# Altium project fitkit4.PrjPcb (part 1 of 2)
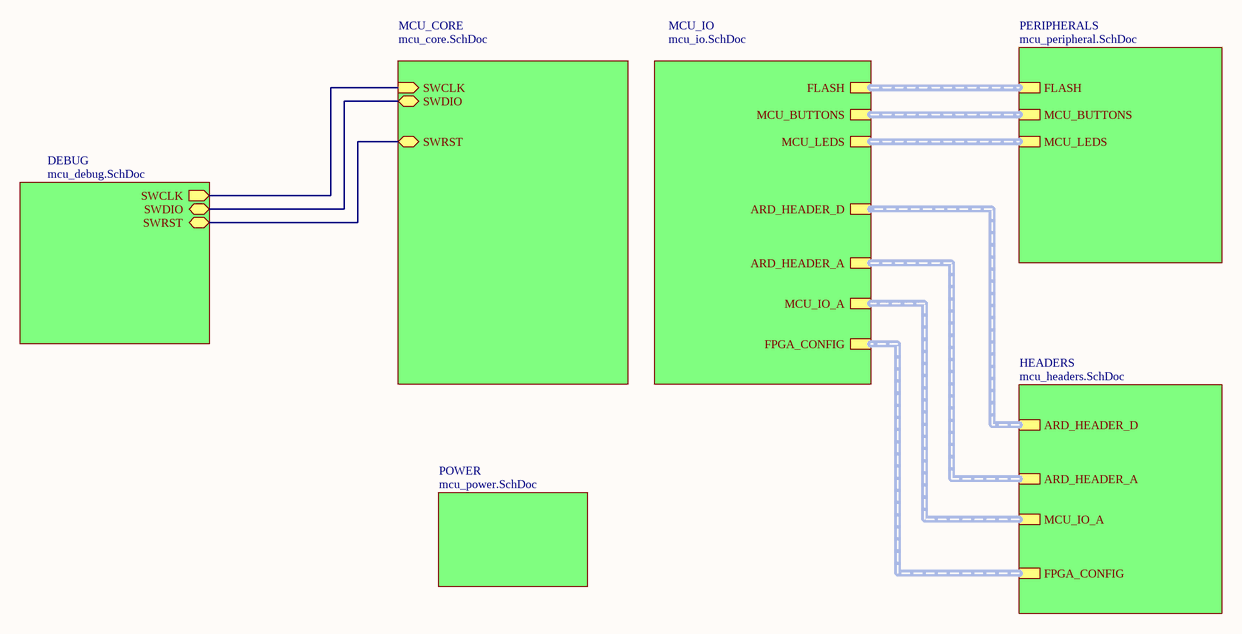
[diagram p0: arm_board.SchDoc]
7 sheets, 88 parts. Net scope: hierarchical (ports join the sheet entries above them; power ports are global).
Board file: arm_board_n.PcbDoc
Sheets:
  arm_board.SchDoc
    MCU_CORE = mcu_core.SchDoc
    DEBUG = mcu_debug.SchDoc
    PERIPHERALS = mcu_peripheral.SchDoc
    POWER = mcu_power.SchDoc
    HEADERS = mcu_headers.SchDoc
    MCU_IO = mcu_io.SchDoc

## Sheet arm_board.SchDoc
size A4

### Sub-sheets
DEBUG = mcu_debug.SchDoc: SWCLK (out), SWDIO (bidir), SWRST (bidir)
HEADERS = mcu_headers.SchDoc: ARD_HEADER_D (harness ARD_HEADER_D), ARD_HEADER_A (harness ARD_HEADER_A), MCU_IO_A (harness MCU_IO_A), FPGA_CONFIG (harness FPGA_CONFIG)
MCU_CORE = mcu_core.SchDoc: SWDIO (bidir), SWCLK (in), SWRST (bidir)
MCU_IO = mcu_io.SchDoc: FLASH (harness FLASH), MCU_BUTTONS (harness MCU_BUTTONS), MCU_LEDS (harness MCU_LEDS), ARD_HEADER_D (harness ARD_HEADER_D), ARD_HEADER_A (harness ARD_HEADER_A), MCU_IO_A (harness MCU_IO_A), FPGA_CONFIG (harness FPGA_CONFIG)
PERIPHERALS = mcu_peripheral.SchDoc: FLASH (harness FLASH), MCU_BUTTONS (harness MCU_BUTTONS), MCU_LEDS (harness MCU_LEDS)
POWER = mcu_power.SchDoc: no entries

### Nets
NetC11_1: sheet MCU_CORE/SWRST, sheet DEBUG/SWRST
NetIC1_P27: sheet MCU_CORE/SWCLK, sheet DEBUG/SWCLK
NetIC1_P30: sheet MCU_CORE/SWDIO, sheet DEBUG/SWDIO

### Buses and harness runs
harness sheet HEADERS/ARD_HEADER_A = sheet MCU_IO/ARD_HEADER_A
harness sheet HEADERS/ARD_HEADER_D = sheet MCU_IO/ARD_HEADER_D
harness sheet HEADERS/FPGA_CONFIG = sheet MCU_IO/FPGA_CONFIG
harness sheet HEADERS/MCU_IO_A = sheet MCU_IO/MCU_IO_A
harness sheet MCU_IO/FLASH = sheet PERIPHERALS/FLASH
harness sheet MCU_IO/MCU_BUTTONS = sheet PERIPHERALS/MCU_BUTTONS
harness sheet MCU_IO/MCU_LEDS = sheet PERIPHERALS/MCU_LEDS

## Sheet mcu_core.SchDoc
size A4
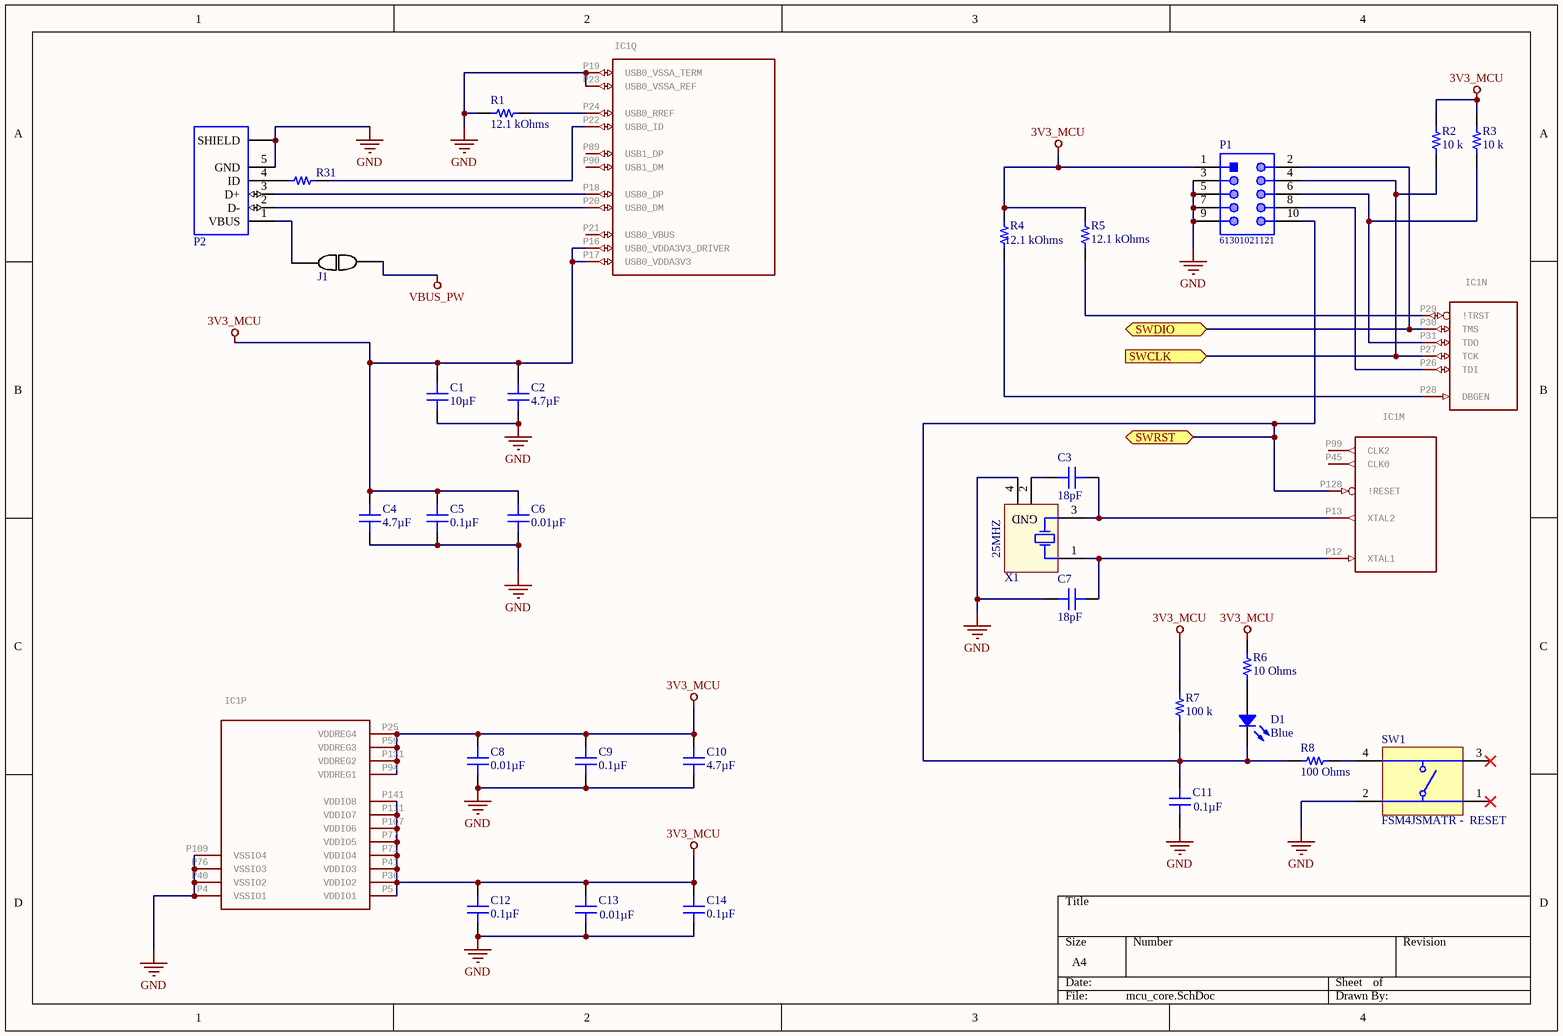
[diagram p1: mcu_core.SchDoc]

### Parts
C1  10µF  [CAP 0603_1608]
C2  4.7µF  [CAP 0603_1608]
C3  18pF  [CAP 0603_1608]
C4  4.7µF  [CAP 0603_1608]
C5  0.1µF  [CAP 0603_1608]
C6  0.01µF  [CAP 0603_1608]
C7  18pF  [CAP 0603_1608]
C8  0.01µF  [CAP 0603_1608]
C9  0.1µF  [CAP 0603_1608]
C10  4.7µF  [CAP 0603_1608]
C11  0.1µF  [CAP 0603_1608]
C12  0.1µF  [CAP 0603_1608]
C13  0.01µF  [CAP 0603_1608]
C14  0.1µF  [CAP 0603_1608]
D1  Blue  [LED 0603_1608 BLUE]
IC1  LQFP144 - SOT486-1    LQFP144: plastic low profile quad flat package; 144 leads; body 20 x 20 x 1.4 mm    body + leads 22 x 22 mm   Solderland (pads) 0.4 x 1.5 mm on corners (8 x) and 0.28 x 1.5 mm (136 x)  [LQFP144]  (value not drawn)  (parts M,N,P,Q of 17)
J1  103185-2  [TE_103185-2]  (value not drawn)
P1  61301021121  [61301021121]
P2  47346-0001  [MOLEX_47346-0001]  (value not drawn)
R1  12.1 kOhms  [RES 0603_1608]
R2  10 k  [RES 0603_1608]
R3  10 k  [RES 0603_1608]
R4  12.1 kOhms  [RES 0603_1608]
R5  12.1 kOhms  [RES 0603_1608]
R6  10 Ohms  [RES 0603_1608]
R7  100 k  [RES 0603_1608]
R8  100 Ohms  [RES 0603_1608]
R31  (no value)  [RES 0603_1608]
SW1  FSM4JSMATR -  RESET  [TECO-FSM4JSMATR_V]
X1  25MHZ  [ABRA-ABMM2-4_V]

### Ports
SWCLK (in), SWDIO (bidir), SWRST (bidir)

### Nets
3V3_MCU: C1.2 C2.2 C4.2 C5.2 C6.2 C8.2 C9.2 C10.2 C12.2 C13.2 C14.2 IC1.P5(VDDIO1) IC1.P16(USB0_VDDA3V3_DRIVER) IC1.P17(USB0_VDDA3V3) IC1.P25(VDDREG4) IC1.P36(VDDIO2) IC1.P41(VDDIO3) IC1.P59(VDDREG3) IC1.P71(VDDIO4) IC1.P77(VDDIO5) IC1.P94(VDDREG1) IC1.P107(VDDIO6) IC1.P111(VDDIO7) IC1.P131(VDDREG2) IC1.P141(VDDIO8) P1.1 R2.2 R3.2 R4.2 R5.2 R6.2 R7.1
GND: C1.1 C2.1 C4.1 C5.1 C6.1 C7.1 C8.1 C9.1 C10.1 C11.2 C12.1 C13.1 C14.1 IC1.P4(VSSIO1) IC1.P19(USB0_VSSA_TERM) IC1.P23(USB0_VSSA_REF) IC1.P40(VSSIO2) IC1.P76(VSSIO3) IC1.P109(VSSIO4) P1.3 P1.5 P1.7 P1.9 P2.5(GND) P2.SH1(SHIELD) P2.SH2(SHIELD) P2.SH3(SHIELD) P2.SH4(SHIELD) P2.SH5(SHIELD) P2.SH6(SHIELD) R1.2 SW1.2 X1.4(GND)
VBUS_PW: J1.1  [project net 5V]
NetC3_1: C3.1 X1.2(GND)
NetC3_2: C3.2 IC1.P13(XTAL2) X1.3(X2)
NetC7_2: C7.2 IC1.P12(XTAL1) X1.1(X1)
NetC11_1: C11.1 D1.2 IC1.P128(!RESET) P1.10 R7.2 R8.2 ; port SWRST
NetD1_1: D1.1 R6.1
NetIC1_P18: IC1.P18(USB0_DP) P2.3(D+)
NetIC1_P20: IC1.P20(USB0_DM) P2.2(D-)
NetIC1_P22: IC1.P22(USB0_ID) R31.2
NetIC1_P24: IC1.P24(USB0_RREF) R1.1
NetIC1_P26: IC1.P26(TDI) P1.8
NetIC1_P27: IC1.P27(TCK) P1.4 R2.1 ; port SWCLK
NetIC1_P28: IC1.P28(DBGEN) R4.1
NetIC1_P29: IC1.P29(!TRST) R5.1
NetIC1_P30: IC1.P30(TMS) P1.2 ; port SWDIO
NetIC1_P31: IC1.P31(TDO) P1.6 R3.1
NetJ1_2: J1.2 P2.1(VBUS)
NetP2_4: P2.4(ID) R31.1
NetR8_1: R8.1 SW1.4

Not connected (* = marked no-connect by the designer): IC1 P21(USB0_VBUS) P45(CLK0) P89(USB1_DP) P90(USB1_DM) P99(CLK2); SW1 1* 3*

### Library data of the parts
C1 = GRM188R61A106MAALD: CAP CER 10UF 10V X5R 0603; Manufacturer: Murata Electronics; Tolerance: ±20%; Part Number: GRM188R61A106MAALD; Value: 10µF; Applications: General Purpose; Capacitance: 10µF; ComponentLink1Description: Datasheet; ComponentLink1URL: https://search.murata.co.jp/Ceramy/image/img/A01X/G101/ENG/GRM188R61A106MAAL-01.pdf; ComponentLink2Description: DigiKey Link; ComponentLink2URL: http://digikey.com/product-detail/en/murata-electronics/GRM188R61A106MAALD/490-12734-1-ND/5797703; Device Package: 0603 (1608 Metric); LastUpdated: 02.09.2020 1:03:35; Lifecycle Status: Active; Minimum Order: 1; Mounting Type: Surface Mount, MLCC; Operating Temperature: -55°C ~ 85°C; Package / Case: 0603 (1608 Metric); Packaging: TapeAndReel; PartId: 2423; Part Status: Active; Price: 0.08; Series: GRM; Size / Dimension: 0.063" L x 0.031" W (1.60mm x 0.80mm); Supplier 1: DigiKey; Supplier Part Number 1: 490-12734-1-ND; Temperature Coefficient: X5R; Thickness (Max): 0.037" (0.95mm); Voltage - Rated: 10V
C2 C4 C10 = LMK107BJ475KA-T: CAP CER 4.7UF 10V X5R 0603; Manufacturer: Taiyo Yuden; Tolerance: ±10%; Part Number: LMK107BJ475KA-T; Value: 4.7µF; Applications: General Purpose; Capacitance: 4.7µF; ComponentLink1Description: Datasheet; ComponentLink1URL: https://ds.yuden.co.jp/TYCOMPAS/ut/detail?pn=LMK107BJ475KA-T  &u=M; ComponentLink2Description: DigiKey Link; ComponentLink2URL: http://digikey.com/product-detail/en/taiyo-yuden/LMK107BJ475KA-T/587-1441-1-ND/1004072; Device Package: 0603 (1608 Metric); LastUpdated: 02.09.2020 1:03:36; Lifecycle Status: Active; Minimum Order: 1; Mounting Type: Surface Mount, MLCC; Operating Temperature: -55°C ~ 85°C; Package / Case: 0603 (1608 Metric); Packaging: TapeAndReel; PartId: 2244; Part Status: Active; Price: 0.03; Series: M; Size / Dimension: 0.063" L x 0.031" W (1.60mm x 0.80mm); Supplier 1: DigiKey; Supplier Part Number 1: 587-1441-1-ND; Temperature Coefficient: X5R; Thickness (Max): 0.035" (0.90mm); Voltage - Rated: 10V
C3 C7 = VJ0603A180FXQCW1BC: CAP CER 18PF 10V C0G/NP0 0603; Manufacturer: Vishay Vitramon; Temperature Coefficient: C0G, NP0; Tolerance: ±1%; Part Number: VJ0603A180FXQCW1BC; Value: 18pF; Applications: General Purpose; Capacitance: 18pF; ComponentLink1Description: Datasheet; ComponentLink1URL: https://www.vishay.com/docs/28548/vjw1bcbascomseries.pdf; ComponentLink2Description: DigiKey Link; ComponentLink2URL: http://digikey.com/product-detail/en/vishay-vitramon/VJ0603A180FXQCW1BC/720-1660-1-ND/8324080; Device Package: 0603 (1608 Metric); LastUpdated: 02.09.2020 1:03:27; Lifecycle Status: Active; Minimum Order: 1; Mounting Type: Surface Mount, MLCC; Operating Temperature: -55°C ~ 125°C; Package / Case: 0603 (1608 Metric); Packaging: TapeAndReel; PartId: 7094; Part Status: Active; Price: 0.04; Series: VJ; Size / Dimension: 0.063" L x 0.031" W (1.60mm x 0.80mm); Supplier 1: DigiKey; Supplier Part Number 1: 720-1660-1-ND; Thickness (Max): 0.034" (0.87mm); Voltage - Rated: 10V
C5 C9 C12 C14 = C0603C104K5RAC7411: CAP CER 0.1UF 50V X7R 0603; Manufacturer: KEMET; Tolerance: ±10%; Part Number: C0603C104K5RAC7411; Value: 0.1µF; Applications: Bypass, Decoupling; Capacitance: 0.1µF; ComponentLink1Description: Datasheet; ComponentLink1URL: https://api.kemet.com/component-edge/download/datasheet/C0603C104K5RAC7411.pdf; ComponentLink2Description: DigiKey Link; ComponentLink2URL: http://digikey.com/product-detail/en/kemet/C0603C104K5RAC7411/399-7374-2-ND/3317013; Device Package: 0603 (1608 Metric); LastUpdated: 02.09.2020 1:03:36; Lifecycle Status: Active; Minimum Order: 15000; Mounting Type: Surface Mount, MLCC; Operating Temperature: -55°C ~ 125°C; Package / Case: 0603 (1608 Metric); Packaging: TapeAndReel; PartId: 2233; Part Status: Active; Price: 0.02; Series: SMD Comm X7R; Size / Dimension: 0.063" L x 0.031" W (1.60mm x 0.80mm); Supplier 1: DigiKey; Supplier Part Number 1: 399-7374-2-ND; Temperature Coefficient: X7R; Thickness (Max): 0.035" (0.90mm); Voltage - Rated: 50V
C6 C8 C13 = C0603C103KARACAUTO: CAP CER 0.01UF 250V X7R 0603; Manufacturer: KEMET; Tolerance: ±10%; Part Number: C0603C103KARACAUTO; Value: 0.01µF; Applications: Automotive, Bypass, Decoupling; Capacitance: 0.01µF; ComponentLink1Description: Datasheet; ComponentLink1URL: https://api.kemet.com/component-edge/download/datasheet/C0603C103KARACAUTO.pdf; ComponentLink2Description: DigiKey Link; ComponentLink2URL: http://digikey.com/product-detail/en/kemet/C0603C103KARACAUTO/399-17960-1-ND/9084030; Device Package: 0603 (1608 Metric); LastUpdated: 02.09.2020 1:03:10; Lifecycle Status: Active; Minimum Order: 1; Mounting Type: Surface Mount, MLCC; Operating Temperature: -55°C ~ 125°C; Package / Case: 0603 (1608 Metric); Packaging: TapeAndReel; PartId: 15195; Part Status: Active; Price: 0.25; Ratings: AEC-Q200; Series: SMD Auto X7R; Size / Dimension: 0.063" L x 0.031" W (1.60mm x 0.80mm); Supplier 1: DigiKey; Supplier Part Number 1: 399-17960-1-ND; Temperature Coefficient: X7R; Thickness (Max): 0.034" (0.87mm); Voltage - Rated: 250V
C11 = C0603T104K8RAC7867: CAP CER 0.1UF 10V X7R 0603; Manufacturer: KEMET; Ratings: COTS; Tolerance: ±10%; Part Number: C0603T104K8RAC7867; Value: 0.1µF; Applications: High Reliability, Bypass, Decoupling; Capacitance: 0.1µF; ComponentLink1Description: Datasheet; ComponentLink1URL: https://api.kemet.com/component-edge/download/datasheet/C0603T104K8RAC7867.pdf; ComponentLink2Description: DigiKey Link; ComponentLink2URL: http://digikey.com/product-detail/en/kemet/C0603T104K8RAC7867/399-20424-1-ND/9925028; Device Package: 0603 (1608 Metric); LastUpdated: 02.09.2020 1:03:35; Lifecycle Status: Active; Minimum Order: 1; Mounting Type: Surface Mount, MLCC; Operating Temperature: -55°C ~ 125°C; Package / Case: 0603 (1608 Metric); Packaging: TapeAndReel; PartId: 2528; Part Status: Active; Price: 0.23; Series: SMD COTS X7R; Size / Dimension: 0.063" L x 0.031" W (1.60mm x 0.80mm); Supplier 1: DigiKey; Supplier Part Number 1: 399-20424-1-ND; Temperature Coefficient: X7R; Thickness (Max): 0.034" (0.87mm); Voltage - Rated: 10V
D1 = VLMB1300-GS08: LED BLUE 0603 SMD; Manufacturer: Vishay Semiconductor Opto Division; Configuration: Standard; Current - Test: 20mA; Lens Color: 1.00mm; Lens Size: 1.10mm x 0.80mm; Lens Style: Rectangle with Flat Top; Millicandela Rating: 104mcd; Viewing Angle: 130°; Voltage - Forward (Vf) (Typ): 3.3V; Wavelength - Dominant: 470nm; Wavelength - Peak: 468nm; Part Number: VLMB1300-GS08; Color: Blue; ComponentLink1Description: Datasheet; ComponentLink1URL: http://www.vishay.com/docs/82437/vlmo1300.pdf; ComponentLink2Description: DigiKey Link; ComponentLink2URL: http://digikey.com/product-detail/en/vishay-semiconductor-opto-division/VLMB1300-GS08/VLMB1300-GS08CT-ND/3025485; Device Package: 0603 (1608 Metric); Height (Max): 1.00mm; LastUpdated: 02.09.2020 1:20:26; Lifecycle Status: Active; Minimum Order: 1; Mounting Type: Surface Mount; Package / Case: 0603 (1608 Metric); Packaging: TapeAndReel; PartId: 785; Part Status: Active; Price: 0.08; Series: CHIPLED; Size / Dimension: 1.60mm L x 0.80mm W; Supplier 1: DigiKey; Supplier Part Number 1: VLMB1300-GS08CT-ND; Supplier Device Package: 0603; Value: Blue
IC1 = LPC4300_LQFP144: GateName_1: G$1; SymbolName_1: 144_0_PORT0; GateName_2: G$2; SymbolName_2: 144_1_PORT1; GateName_3: G$3; SymbolName_3: 144_2_PORT2; GateName_4: G$4; SymbolName_4: 144_3_PORT3; GateName_5: G$5; SymbolName_5: 144_4_PORT4; GateName_6: G$6; SymbolName_6: 144_5_PORT5; GateName_7: G$7; SymbolName_7: 144_6_PORT6; GateName_8: G$8; SymbolName_8: 144_7_PORT7; GateName_9: G$9; SymbolName_9: 144_9_PORT9; GateName_10: G$10; SymbolName_10: 144_15_PORTF; GateName_11: G$11; SymbolName_11: 144_16_ANA; GateName_12: G$12; SymbolName_12: 144_17_RTC; GateName_13: G$13; SymbolName_13: 144_18_CLK; GateName_14: G$14; SymbolName_14: 144_19_DBUG; GateName_15: G$15; SymbolName_15: 144_20_I2C; GateName_16: G$16; SymbolName_16: 144_21_SUP; GateName_17: G$17; SymbolName_17: 144_22_USB; LibraryName: LPC4300; DeviceSetName: LPC4300_LQFP144; Package: LQFP144
J1 = 103185-2: 02 MODII HDR SRST B/A .100CL; Package: None; Price: None; Value: *; MP: 103185-2; Availability: Unavailable
P1 = CMP-1502-01084-1: THT Vertical Pin Header WR-PHD, Pitch 2.54 mm, Dual Row, 10 pins; Manufacturer: Wurth Elektronik; Working Voltage: 250VAC; Pitch: 2.54mm; Contact Resistance: 20mOhm; Gender: Male; Rated Current: 3A; Withstanding Voltage: 500VAC; Pin Number: 10; Operating Temperature: -40to105degC; Mounting Technology: THT; Publisher: WurthElektronik; Manufacturer URL: http://www.we-online.de; Part Number: 61301021121; Row Number: Dual; Packaging: Bag; Orientation: Vertical; Package Reference: 61301021121; Datasheet URL: https://katalog.we-online.de/em/datasheet/6130xx21121.pdf
P2 = 47346-0001: CONN RCPT 5POS MICRO USB R/A  SMD; Value: *; Supplier 1: Farnell; Supplier Part Number 1: 1568026; Supplier 2: Mouser; Supplier Part Number 2: 538-47346-0001
R1 R4 R5 = CR0603-FX-1212ELF: RES SMD 12.1K OHM 1% 1/10W 0603; Manufacturer: Bourns Inc.; Power (Watts): 0.1W, 1/10W; Temperature Coefficient: ±100ppm/°C; Part Number: CR0603-FX-1212ELF; Value: 12.1 kOhms; ComponentLink1Description: Datasheet; ComponentLink1URL: https://www.bourns.com/docs/Product-Datasheets/CHPREZTR.pdf; ComponentLink2Description: DigiKey Link; ComponentLink2URL: http://digikey.com/product-detail/en/bourns-inc/CR0603-FX-1212ELF/CR0603-FX-1212ELFCT-ND/3925302; Composition: Thick Film; Device Package: 0603 (1608 Metric); Features: Moisture Resistant; Height - Seated (Max): 0.022" (0.55mm); LastUpdated: 02.09.2020 1:10:21; Lifecycle Status: Active; Minimum Order: 1; Number of Terminations: 2; Operating Temperature: -55°C ~ 155°C; Package / Case: 0603 (1608 Metric); Packaging: CutTape; PartId: 6585; Part Status: Active; Price: 0.10; Resistance: 12.1 kOhms; Series: CR0603; Size / Dimension: 0.063" L x 0.031" W (1.60mm x 0.80mm); Supplier 1: DigiKey; Supplier Part Number 1: CR0603-FX-1212ELFCT-ND; Supplier Device Package: 0603; Tolerance: ±1%
R2 R3 = RNCS0603BKE10K0: RES 10K OHM 0.1% 1/16W 0603; Manufacturer: Stackpole Electronics Inc; Power (Watts): 0.063W, 1/16W; Resistance: 10 kOhms; Temperature Coefficient: ±25ppm/°C; Part Number: RNCS0603BKE10K0; Value: 10 k; ComponentLink1Description: Datasheet; ComponentLink1URL: https://www.seielect.com/catalog/sei-rncs_rnch.pdf; ComponentLink2Description: DigiKey Link; ComponentLink2URL: http://digikey.com/product-detail/en/stackpole-electronics-inc/RNCS0603BKE10K0/RNCS0603BKE10K0CT-ND/1800113; Composition: Thin Film; Device Package: 0603 (1608 Metric); Features: Anti-Corrosive, Automotive AEC-Q200, Moisture Resistant; Height - Seated (Max): 0.022" (0.55mm); LastUpdated: 02.09.2020 1:10:25; Lifecycle Status: Active; Minimum Order: 1; Number of Terminations: 2; Operating Temperature: -55°C ~ 155°C; Package / Case: 0603 (1608 Metric); Packaging: TapeAndReel; PartId: 4838; Part Status: Active; Price: 0.08; Ratings: AEC-Q200; Series: RNCS; Size / Dimension: 0.061" L x 0.031" W (1.55mm x 0.80mm); Supplier 1: DigiKey; Supplier Part Number 1: RNCS0603BKE10K0CT-ND; Supplier Device Package: 0603; Tolerance: ±0.1%
R6 = CRT0603-BY-10R0ELF: RES SMD 10 OHM 0.1% 1/10W 0603; Manufacturer: Bourns Inc.; Power (Watts): 0.1W, 1/10W; Temperature Coefficient: ±25ppm/°C; Part Number: CRT0603-BY-10R0ELF; Value: 10 Ohms; ComponentLink1Description: Datasheet; ComponentLink1URL: https://www.bourns.com/docs/Product-Datasheets/crt.pdf; ComponentLink2Description: DigiKey Link; ComponentLink2URL: http://digikey.com/product-detail/en/bourns-inc/CRT0603-BY-10R0ELF/CRT0603-BY-10R0ELFCT-ND/1775043; Composition: Thin Film; Device Package: 0603 (1608 Metric); Features: Current Sense; Height - Seated (Max): 0.024" (0.60mm); LastUpdated: 02.09.2020 1:10:25; Lifecycle Status: Active; Minimum Order: 1; Number of Terminations: 2; Operating Temperature: -55°C ~ 155°C; Package / Case: 0603 (1608 Metric); Packaging: TapeAndReel; PartId: 4866; Part Status: Active; Price: 0.05; Resistance: 10 Ohms; Series: CRT; Size / Dimension: 0.061" L x 0.031" W (1.55mm x 0.80mm); Supplier 1: DigiKey; Supplier Part Number 1: CRT0603-BY-10R0ELFCT-ND; Supplier Device Package: 0603; Tolerance: ±0.1%
R7 = RMCF0603JT100K: RES 100K OHM 5% 1/10W 0603; Manufacturer: Stackpole Electronics Inc; Power (Watts): 0.1W, 1/10W; Resistance: 100 kOhms; Temperature Coefficient: ±200ppm/°C; Part Number: RMCF0603JT100K; Value: 100 k; ComponentLink1Description: Datasheet; ComponentLink1URL: https://www.seielect.com/catalog/sei-rmcf_rmcp.pdf; ComponentLink2Description: DigiKey Link; ComponentLink2URL: http://digikey.com/product-detail/en/stackpole-electronics-inc/RMCF0603JT100K/RMCF0603JT100KCT-ND/1943203; Composition: Thick Film; Device Package: 0603 (1608 Metric); Features: Automotive AEC-Q200; Height - Seated (Max): 0.022" (0.55mm); LastUpdated: 02.09.2020 1:10:23; Lifecycle Status: Active; Minimum Order: 1; Number of Terminations: 2; Operating Temperature: -55°C ~ 155°C; Package / Case: 0603 (1608 Metric); Packaging: CutTape; PartId: 5863; Part Status: Active; Price: 0.10; Ratings: AEC-Q200; Series: RMCF; Size / Dimension: 0.061" L x 0.031" W (1.55mm x 0.80mm); Supplier 1: DigiKey; Supplier Part Number 1: RMCF0603JT100KCT-ND; Supplier Device Package: 0603; Tolerance: ±5%
R8 = RNCS0603BKE100R: RES 100 OHM 0.1% 1/16W 0603; Manufacturer: Stackpole Electronics Inc; Power (Watts): 0.063W, 1/16W; Temperature Coefficient: ±25ppm/°C; Part Number: RNCS0603BKE100R; Value: 100 Ohms; ComponentLink1Description: Datasheet; ComponentLink1URL: https://www.seielect.com/catalog/sei-rncs_rnch.pdf; ComponentLink2Description: DigiKey Link; ComponentLink2URL: http://digikey.com/product-detail/en/stackpole-electronics-inc/RNCS0603BKE100R/RNCS0603BKE100RCT-ND/1800117; Composition: Thin Film; Device Package: 0603 (1608 Metric); Features: Anti-Corrosive, Automotive AEC-Q200, Moisture Resistant; Height - Seated (Max): 0.022" (0.55mm); LastUpdated: 02.09.2020 1:10:25; Lifecycle Status: Active; Minimum Order: 1; Number of Terminations: 2; Operating Temperature: -55°C ~ 155°C; Package / Case: 0603 (1608 Metric); Packaging: TapeAndReel; PartId: 4839; Part Status: Active; Price: 0.08; Ratings: AEC-Q200; Resistance: 100 Ohms; Series: RNCS; Size / Dimension: 0.061" L x 0.031" W (1.55mm x 0.80mm); Supplier 1: DigiKey; Supplier Part Number 1: RNCS0603BKE100RCT-ND; Supplier Device Package: 0603; Tolerance: ±0.1%
R31 = TLRZ1JTTD: RES 0 OHM JUMPER 0603; Manufacturer: KOA Speer Electronics, Inc.; Part Number: TLRZ1JTTD; ComponentLink1Description: Datasheet; ComponentLink1URL: http://www.koaspeer.com/catimages/Products/TLRZ/TLRZ.pdf; ComponentLink2Description: DigiKey Link; ComponentLink2URL: http://digikey.com/product-detail/en/koa-speer-electronics-inc/TLRZ1JTTD/2019-TLRZ1JTTDCT-ND/9847537; Composition: Metal Element; Device Package: 0603 (1608 Metric); Features: Automotive AEC-Q200, Current Sense; Height - Seated (Max): 0.022" (0.55mm); LastUpdated: 02.09.2020 1:10:25; Lifecycle Status: Active; Minimum Order: 1; Number of Terminations: 2; Operating Temperature: -55°C ~ 170°C; Package / Case: 0603 (1608 Metric); Packaging: TapeAndReel; PartId: 4851; Part Status: Active; Price: 0.08; Ratings: AEC-Q200; Series: TLRZ; Size / Dimension: 0.063" L x 0.031" W (1.60mm x 0.80mm); Supplier 1: DigiKey; Supplier Part Number 1: 2019-TLRZ1JTTDCT-ND; Supplier Device Package: 0603; Tolerance: Jumper
SW1 = CMP-2000-07486-1: Micro Miniature Push Button Switch FSM JSM, 50 mA, -35 to 85 degC, 4-Pin SMD, RoHS, Tape and Reel; Manufacturer: TE Connectivity; Mechanical Life: 100000Cycles; Current Rating: 50mA; Actuator Material: Polyamide; Max Voltage Rating (DC): 12V; Capacitance: 0f; Illumination Type: Illuminated; Voltage Rating (DC): 24V; Case\/Package: SMD/SMT; Operating Force: 160gf; Contact Resistance: 100mOhm; Actuator Length: 0.055inch; Switch Travel: 0.25mm; Throw Configuration: SPST; Termination: GullWing; Contact Plating: Silver; Orientation: Straight; Mounting Technology: SurfaceMount; REACH SVHC: Unknown; Electrical Life: 100000Cycles; Package Reference: FSM4JSMATR; Max Operating Temperature: 85degC; Manufacturer URL: http://www.te.com/; Package Description: 4-Pin Surface Mount Device, Body 6 x 6 mm, Pitch 4.5 mm; Datasheet Version: Rev. V, 02/2015; Packaging: TapeandReel; Min Operating Temperature: -35degC; Mount: SurfaceMount; Contact Current Rating: 50mA; Contact Material: CopperAlloy; Package Quantity: 1200; Datasheet URL: http://www.te.com/commerce/DocumentDelivery/DDEController?Action=showdoc&DocId=Customer+Drawing%7F2-1437565-7%7FV%7Fpdf%7FEnglish%7FENG_CD_2-1437565-7_V.pdf%7F4-1437565-2; RoHSCompliant: true
X1 = CMP-0277-00003-1: Ceramic Surface Mount Low Profile Quartz Crystal, 8 MHz, -20 to 70 degC, 4-Pin 6 x 3.6 x 1.2 mm SMD, RoHS, 1000pcs / Reel; Manufacturer: Abracon; PartNumber: ABMM2-8.000MHZ-E2-T; ESR: 72 Ohm Max.; Frequency: 8 MHz; Shunt Capacitance C0: 7 pF Max.; Load Capacitance CL: 18 pF Typ.; ComponentLink3Description: Package Specification; PackageDescription: 4-Pin SMD, Body 6 x 3.6 mm, Pitch 4.4 mm; DatasheetVersion: Jan-13; ComponentLink1URL: http://www.abracon.com/; ComponentLink2URL: http://www.abracon.com/Resonators/ABMM2.pdf; Temperature Range: -20 to 70 degC; Mounting Technology: Surface Mount; RoHS: TRUE; ComponentLink2Description: Datasheet; ComponentLink3URL: http://www.abracon.com/Resonators/ABMM2.pdf; ComponentLink1Description: Manufacturer URL; Packing: 1000pcs / Reel

## Sheet mcu_debug.SchDoc: ARM debug probe
size A4; Author: Pavel Koupý; Revision: 1.0
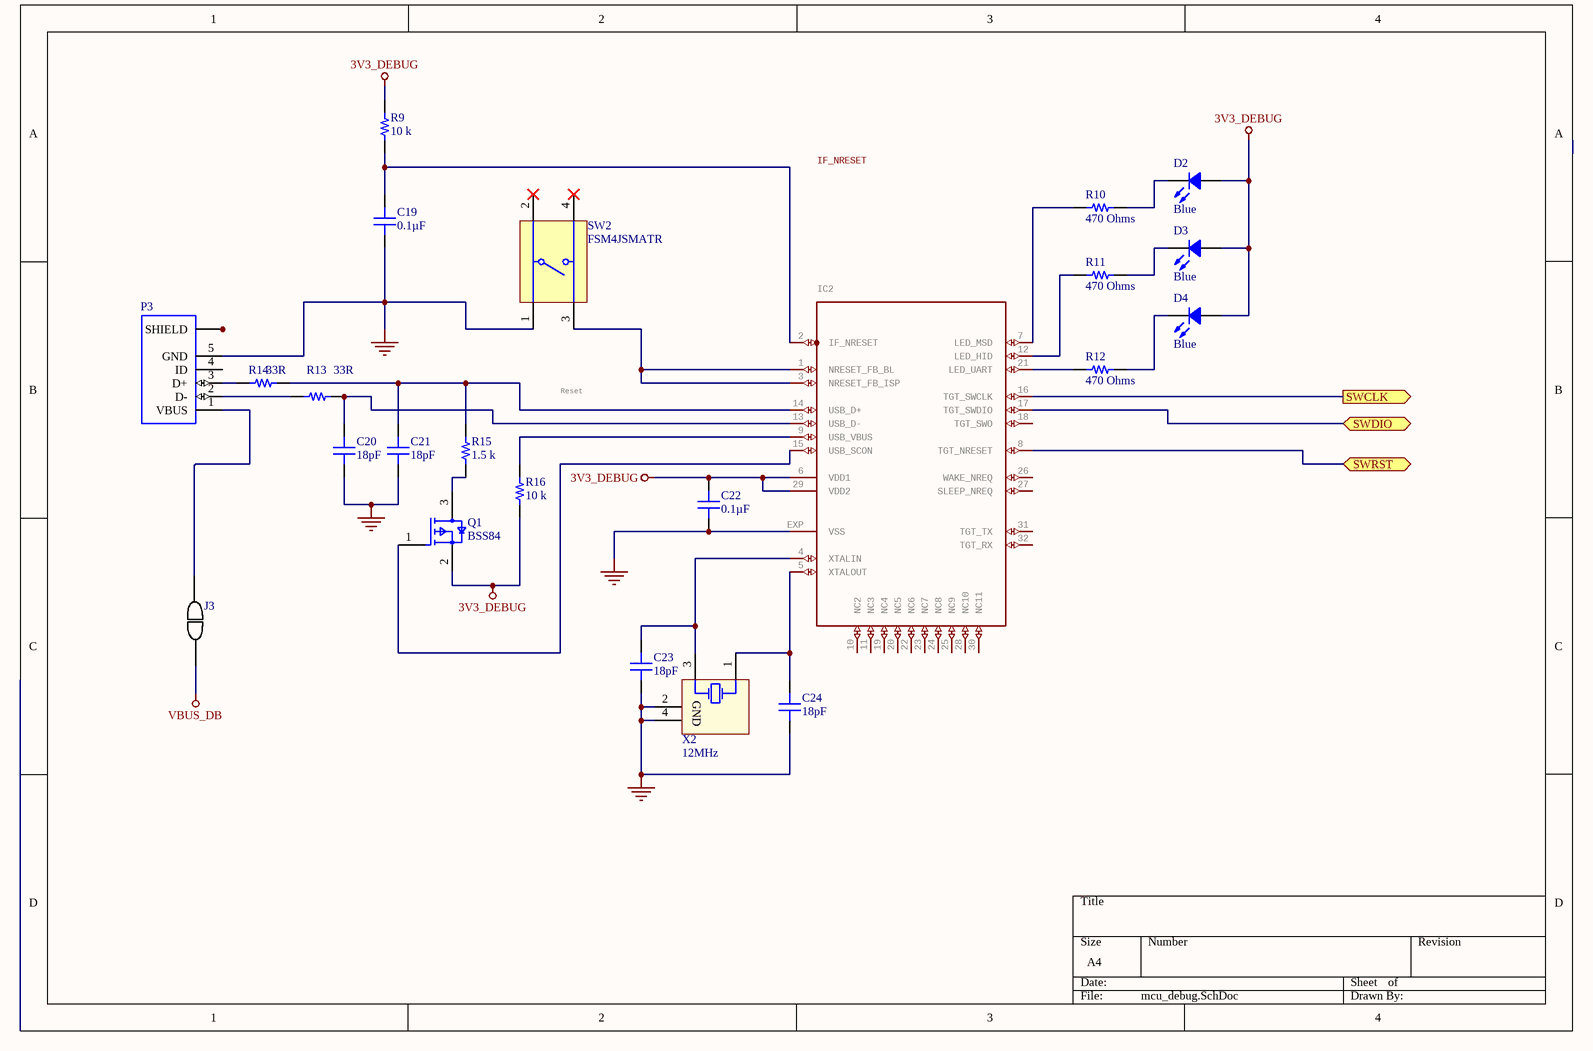
[diagram p2: mcu_debug.SchDoc]

### Parts
C19  0.1µF  [CAP 0603_1608]
C20  18pF  [CAP 0603_1608]
C21  18pF  [CAP 0603_1608]
C22  0.1µF  [CAP 0603_1608]
C23  18pF  [CAP 0603_1608]
C24  18pF  [CAP 0603_1608]
D2  Blue  [LED 0603_1608 BLUE]
D3  Blue  [LED 0603_1608 BLUE]
D4  Blue  [LED 0603_1608 BLUE]
IC2  CMSIS-DAP Interface : 32-bit LPC11U00 ARM Cortex M3 RISC 64KB Flash 2.5V/3.3V 33-Pin HVQFN EP  [HVQFN33]  (value not drawn)
J3  103185-2  [TE_103185-2]  (value not drawn)
P3  47346-0001  [MOLEX_47346-0001]  (value not drawn)
Q1  BSS84  [FP-SOT23-MFG]
R9  10 k  [RES 0603_1608]
R10  470 Ohms  [RES 0603_1608]
R11  470 Ohms  [RES 0603_1608]
R12  470 Ohms  [RES 0603_1608]
R13  33R  [RES 0603_1608]
R14  33R  [RES 0603_1608]
R15  1.5 k  [RES 0603_1608]
R16  10 k  [RES 0603_1608]
SW2  FSM4JSMATR  [TECO-FSM4JSMATR_V]
X2  12MHz  [ABRA-ABMM2-4_V]

### Ports
SWCLK (out), SWDIO (bidir), SWRST (bidir)

### Nets
3V3_DEBUG: C22.2 D2.1 D3.1 D4.1 IC2.6(VDD1) IC2.29(VDD2) Q1.2(S) R9.2 R16.1
GND: C19.1 C20.1 C21.1 C22.1 C23.1 C24.1 IC2.EXP(VSS) P3.5(GND) SW2.1 X2.2(GND) X2.4(GND)
VBUS_DB: J3.1  [project net 5V]
NetC11_1: IC2.8(TGT_NRESET) ; port SWRST
NetC19_2: C19.2 IC2.2(IF_NRESET) R9.1
NetC20_2: C20.2 IC2.13(USB_D-) R13.2
NetC21_2: C21.2 IC2.14(USB_D+) R14.2 R15.2
NetC23_2: C23.2 IC2.4(XTALIN) X2.3(X2)
NetC24_2: C24.2 IC2.5(XTALOUT) X2.1(X1)
NetD2_2: D2.2 R10.2
NetD3_2: D3.2 R11.2
NetD4_2: D4.2 R12.2
NetIC1_P27: IC2.16(TGT_SWCLK) ; port SWCLK
NetIC1_P30: IC2.17(TGT_SWDIO) ; port SWDIO
NetIC2_1: IC2.1(NRESET_FB_BL) IC2.3(NRESET_FB_ISP) SW2.3
NetIC2_7: IC2.7(LED_MSD) R10.1
NetIC2_9: IC2.9(USB_VBUS) R16.2
NetIC2_12: IC2.12(LED_HID) R11.1
NetIC2_15: IC2.15(USB_SCON) Q1.1(G)
NetIC2_21: IC2.21(LED_UART) R12.1
NetJ3_2: J3.2 P3.1(VBUS)
NetP3_2: P3.2(D-) R13.1
NetP3_3: P3.3(D+) R14.1
NetP3_SH1: P3.SH1(SHIELD) P3.SH2(SHIELD) P3.SH3(SHIELD) P3.SH4(SHIELD) P3.SH5(SHIELD) P3.SH6(SHIELD)
NetQ1_3: Q1.3(D) R15.1

Not connected (* = marked no-connect by the designer): IC2 10(NC2) 11(NC3) 18(TGT_SWO) 19(NC4) 20(NC5) 22(NC6) 23(NC7) 24(NC8) 25(NC9) 26(WAKE_NREQ) 27(SLEEP_NREQ) 28(NC10) 30(NC11) 31(TGT_TX) 32(TGT_RX); P3 4(ID); SW2 2* 4*

### Notes on the sheet
- Reset
- Labels drawn without touching a wire or pin: IF_NRESET

### Library data of the parts
C19 C22 = C0603T104K8RAC7867: as C11 on sheet mcu_core; Part Number: C0603T104K8RAC7867; Value: 0.1µF; Applications: High Reliability, Bypass, Decoupling; Capacitance: 0.1µF; ComponentLink1Description: Datasheet; ComponentLink1URL: https://api.kemet.com/component-edge/download/datasheet/C0603T104K8RAC7867.pdf; ComponentLink2Description: DigiKey Link; ComponentLink2URL: http://digikey.com/product-detail/en/kemet/C0603T104K8RAC7867/399-20424-1-ND/9925028; Device Package: 0603 (1608 Metric); LastUpdated: 02.09.2020 1:03:35; Lifecycle Status: Active; Minimum Order: 1; Mounting Type: Surface Mount, MLCC; Operating Temperature: -55°C ~ 125°C; Package / Case: 0603 (1608 Metric); Packaging: TapeAndReel; PartId: 2528; Part Status: Active; Price: 0.23; Series: SMD COTS X7R; Size / Dimension: 0.063" L x 0.031" W (1.60mm x 0.80mm); Supplier 1: DigiKey; Supplier Part Number 1: 399-20424-1-ND; Temperature Coefficient: X7R; Thickness (Max): 0.034" (0.87mm); Voltage - Rated: 10V
C20 C21 C23 C24 = VJ0603A180FXQCW1BC: as C3 on sheet mcu_core; Part Number: VJ0603A180FXQCW1BC; Value: 18pF; Applications: General Purpose; Capacitance: 18pF; ComponentLink1Description: Datasheet; ComponentLink1URL: https://www.vishay.com/docs/28548/vjw1bcbascomseries.pdf; ComponentLink2Description: DigiKey Link; ComponentLink2URL: http://digikey.com/product-detail/en/vishay-vitramon/VJ0603A180FXQCW1BC/720-1660-1-ND/8324080; Device Package: 0603 (1608 Metric); LastUpdated: 02.09.2020 1:03:27; Lifecycle Status: Active; Minimum Order: 1; Mounting Type: Surface Mount, MLCC; Operating Temperature: -55°C ~ 125°C; Package / Case: 0603 (1608 Metric); Packaging: TapeAndReel; PartId: 7094; Part Status: Active; Price: 0.04; Series: VJ; Size / Dimension: 0.063" L x 0.031" W (1.60mm x 0.80mm); Supplier 1: DigiKey; Supplier Part Number 1: 720-1660-1-ND; Thickness (Max): 0.034" (0.87mm); Voltage - Rated: 10V
D2-D4 = VLMB1300-GS08: as D1 on sheet mcu_core; Part Number: VLMB1300-GS08; Color: Blue; ComponentLink1Description: Datasheet; ComponentLink1URL: http://www.vishay.com/docs/82437/vlmo1300.pdf; ComponentLink2Description: DigiKey Link; ComponentLink2URL: http://digikey.com/product-detail/en/vishay-semiconductor-opto-division/VLMB1300-GS08/VLMB1300-GS08CT-ND/3025485; Device Package: 0603 (1608 Metric); Height (Max): 1.00mm; LastUpdated: 02.09.2020 1:20:26; Lifecycle Status: Active; Minimum Order: 1; Mounting Type: Surface Mount; Package / Case: 0603 (1608 Metric); Packaging: TapeAndReel; PartId: 785; Part Status: Active; Price: 0.08; Series: CHIPLED; Size / Dimension: 1.60mm L x 0.80mm W; Supplier 1: DigiKey; Supplier Part Number 1: VLMB1300-GS08CT-ND; Supplier Device Package: 0603; Value: Blue
IC2 = IF_LPC11U35FHI33/501: GateName_1: G$1; SymbolName_1: IF-LPC11U35; MF: NXP; LibraryName: mbed-HDK-MF-NXP; DeviceSetName: IF_LPC11U35FHI33/501; Package: HVQFN33; MFN: LPC11U35FHI33/501; OC-DIGIKEY: 568-9586-ND; OC-MOUSER: 771-LPC11U35FHI33501; OC-NEWARK: 2115658; Supplier 1: Farnell; Supplier Part Number 1: 2115658
J3 = 103185-2: 02 MODII HDR SRST B/A .100CL; Package: None; Price: None; Value: *; MP: 103185-2; Availability: Unavailable
P3 = 47346-0001: CONN RCPT 5POS MICRO USB R/A  SMD; Value: *; Supplier 1: Farnell; Supplier Part Number 1: 1568026; Supplier 2: Mouser; Supplier Part Number 2: 538-47346-0001
Q1 = CMP-14409-000006-1: MOSFET P-CH 50V 130MA SOT-23; Manufacturer Part Number: BSS84,215; Manufacturer: Nexperia USA Inc.; Drain To Source Breakdown Voltage: -50V; Max Junction Temp: +150°C; Threshold Vgs Min: -0.8V; Turn On Delay Time: 3ns; Power Dissipation: 250mW; Turn Off Delay Time: 7ns; Gate To Source Voltage: 20V; Number Of Channels: 1; Input Capacitace At Vds: 25pF @ -25V; Threshold Vgs Max: -2V; Continuous Drain Current: -130mA; Depletion Mode: False; Drain To Source Resistance: 6Ω; Rthja Max: 500K/W; Octopart: https://octopart.com/bss84%2C215-nexperia-78739375; Ipc Land Pattern Name: SOT95P230X100-3; Drain To Source Voltage: -50V; Lead Free: Yes; Temperature Range High: +150°C; Automotive: No; Device Class L2: Transistors; Package: SOT23; ComponentLink2URL: https://assets.nexperia.com/documents/data-sheet/BSS84.pdf; Category: Trans; RoHS: TRUE; Temperature Range Low: -65°C; ComponentLink2Description: Datasheet; Device Class L1: Discrete Semiconductors; Number Of P Channels: 1; Device Class L3: MOSFETs; Height: 1.1mm; Digikey Description: MOSFET P-CH 50V 130MA SOT-23; Temperature: -65°C to +150°C; Footprint Url: https://assets.nexperia.com/documents/outline-drawing/SOT23.pdf
R9 R16 = RNCS0603BKE10K0: as R2 on sheet mcu_core; Part Number: RNCS0603BKE10K0; Value: 10 k; ComponentLink1Description: Datasheet; ComponentLink1URL: https://www.seielect.com/catalog/sei-rncs_rnch.pdf; ComponentLink2Description: DigiKey Link; ComponentLink2URL: http://digikey.com/product-detail/en/stackpole-electronics-inc/RNCS0603BKE10K0/RNCS0603BKE10K0CT-ND/1800113; Composition: Thin Film; Device Package: 0603 (1608 Metric); Features: Anti-Corrosive, Automotive AEC-Q200, Moisture Resistant; Height - Seated (Max): 0.022" (0.55mm); LastUpdated: 02.09.2020 1:10:25; Lifecycle Status: Active; Minimum Order: 1; Number of Terminations: 2; Operating Temperature: -55°C ~ 155°C; Package / Case: 0603 (1608 Metric); Packaging: TapeAndReel; PartId: 4838; Part Status: Active; Price: 0.08; Ratings: AEC-Q200; Series: RNCS; Size / Dimension: 0.061" L x 0.031" W (1.55mm x 0.80mm); Supplier 1: DigiKey; Supplier Part Number 1: RNCS0603BKE10K0CT-ND; Supplier Device Package: 0603; Tolerance: ±0.1%
R10-R12 = CRCW0603470RJNEAHP: RES SMD 470 OHM 5% 1/4W 0603; Manufacturer: Vishay Dale; Power (Watts): 0.25W, 1/4W; Temperature Coefficient: ±200ppm/°C; Part Number: CRCW0603470RJNEAHP; Value: 470 Ohms; ComponentLink1Description: Datasheet; ComponentLink1URL: http://www.vishay.com/docs/20043/crcwhpe3.pdf; ComponentLink2Description: DigiKey Link; ComponentLink2URL: http://digikey.com/product-detail/en/vishay-dale/CRCW0603470RJNEAHP/541-470SACT-ND/2222809; Composition: Thick Film; Device Package: 0603 (1608 Metric); Features: Automotive AEC-Q200, Pulse Withstanding; Height - Seated (Max): 0.022" (0.55mm); LastUpdated: 02.09.2020 1:09:49; Lifecycle Status: Active; Minimum Order: 1; Number of Terminations: 2; Operating Temperature: -55°C ~ 155°C; Package / Case: 0603 (1608 Metric); Packaging: TapeAndReel; PartId: 21320; Part Status: Active; Price: 0.02; Ratings: AEC-Q200; Resistance: 470 Ohms; Series: CRCW-HP; Size / Dimension: 0.063" L x 0.033" W (1.60mm x 0.85mm); Supplier 1: DigiKey; Supplier Part Number 1: 541-470SACT-ND; Supplier Device Package: 0603; Tolerance: ±5%
R13 R14 = CPF0603B33RE: RES SMD 33 OHM 0.1% 1/16W 0603; Manufacturer: TE Connectivity Passive Product; Power (Watts): 0.063W, 1/16W; Resistance: 33 Ohms; Temperature Coefficient: ±25ppm/°C; Part Number: CPF0603B33RE; Value: 33R; ComponentLink1Description: Datasheet; ComponentLink1URL: https://www.te.com/commerce/DocumentDelivery/DDEController?Action=srchrtrv&DocNm=1773200&DocType=DS&DocLang=English; ComponentLink2Description: DigiKey Link; ComponentLink2URL: http://digikey.com/product-detail/en/te-connectivity-passive-product/CPF0603B33RE/A119909CT-ND/4966507; Composition: Thin Film; Device Package: 0603 (1608 Metric); Height - Seated (Max): 0.022" (0.55mm); LastUpdated: 02.09.2020 1:10:25; Lifecycle Status: Active; Minimum Order: 1; Number of Terminations: 2; Operating Temperature: -55°C ~ 155°C; Package / Case: 0603 (1608 Metric); Packaging: TapeAndReel; PartId: 4881; Part Status: Active; Price: 0.09; Series: CPF, Neohm; Size / Dimension: 0.061" L x 0.031" W (1.55mm x 0.80mm); Supplier 1: DigiKey; Supplier Part Number 1: A119909CT-ND; Supplier Device Package: 0603; Tolerance: ±0.1%
R15 = CRGP0603F1K5: CRGP 0603 1K5 1%; Manufacturer: TE Connectivity Passive Product; Power (Watts): 0.25W, 1/4W; Resistance: 1.5 kOhms; Temperature Coefficient: ±100ppm/°C; Part Number: CRGP0603F1K5; Value: 1.5 k; ComponentLink1Description: Datasheet; ComponentLink1URL: https://www.te.com/commerce/DocumentDelivery/DDEController?Action=srchrtrv&DocNm=9-1773463-9&DocType=DS&DocLang=English; ComponentLink2Description: DigiKey Link; ComponentLink2URL: http://digikey.com/product-detail/en/te-connectivity-passive-product/CRGP0603F1K5/A130418CT-ND/8578250; Composition: Thick Film; Device Package: 0603 (1608 Metric); Features: Pulse Withstanding; Height - Seated (Max): 0.022" (0.55mm); LastUpdated: 02.09.2020 1:10:24; Lifecycle Status: Active; Minimum Order: 1; Number of Terminations: 2; Operating Temperature: -55°C ~ 155°C; Package / Case: 0603 (1608 Metric); Packaging: TapeAndReel; PartId: 5000; Part Status: Active; Price: 0.02; Series: CRGP; Size / Dimension: 0.063" L x 0.031" W (1.60mm x 0.80mm); Supplier 1: DigiKey; Supplier Part Number 1: A130418CT-ND; Supplier Device Package: 0603; Tolerance: ±1%
SW2 = CMP-2000-07486-1: as SW1 on sheet mcu_core; Termination: GullWing; Contact Plating: Silver; Orientation: Straight; Mounting Technology: SurfaceMount; REACH SVHC: Unknown; Electrical Life: 100000Cycles; Package Reference: FSM4JSMATR; Max Operating Temperature: 85degC; Manufacturer URL: http://www.te.com/; Package Description: 4-Pin Surface Mount Device, Body 6 x 6 mm, Pitch 4.5 mm; Datasheet Version: Rev. V, 02/2015; Packaging: TapeandReel; Min Operating Temperature: -35degC; Mount: SurfaceMount; Contact Current Rating: 50mA; Contact Material: CopperAlloy; Package Quantity: 1200; Datasheet URL: http://www.te.com/commerce/DocumentDelivery/DDEController?Action=showdoc&DocId=Customer+Drawing%7F2-1437565-7%7FV%7Fpdf%7FEnglish%7FENG_CD_2-1437565-7_V.pdf%7F4-1437565-2; RoHSCompliant: true
X2 = CMP-0277-00003-1: as X1 on sheet mcu_core; ComponentLink3Description: Package Specification; PackageDescription: 4-Pin SMD, Body 6 x 3.6 mm, Pitch 4.4 mm; DatasheetVersion: Jan-13; ComponentLink1URL: http://www.abracon.com/; ComponentLink2URL: http://www.abracon.com/Resonators/ABMM2.pdf; Temperature Range: -20 to 70 degC; Mounting Technology: Surface Mount; RoHS: TRUE; ComponentLink2Description: Datasheet; ComponentLink3URL: http://www.abracon.com/Resonators/ABMM2.pdf; ComponentLink1Description: Manufacturer URL; Packing: 1000pcs / Reel

## Sheet mcu_peripheral.SchDoc
size A4
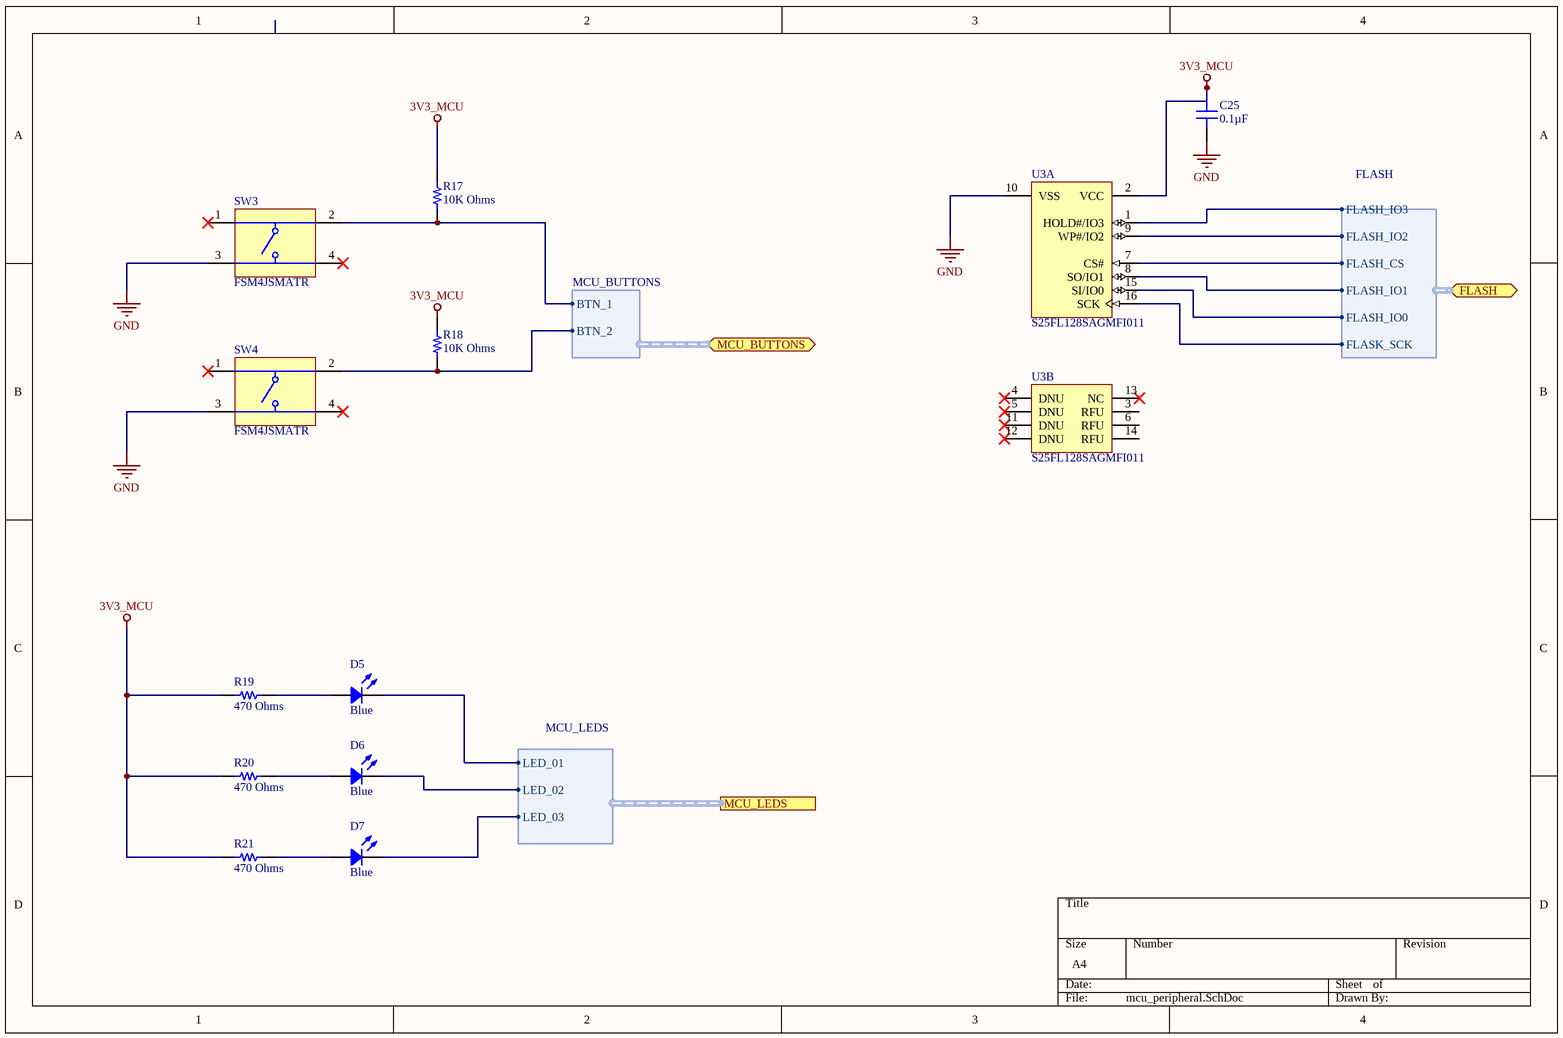
[diagram p3: mcu_peripheral.SchDoc]

### Parts
C25  0.1µF  [CAP 0603_1608]
D5  Blue  [LED 0603_1608 BLUE]
D6  Blue  [LED 0603_1608 BLUE]
D7  Blue  [LED 0603_1608 BLUE]
R17  10K Ohms  [RES 0603_1608]
R18  10K Ohms  [RES 0603_1608]
R19  470 Ohms  [RES 0603_1608]
R20  470 Ohms  [RES 0603_1608]
R21  470 Ohms  [RES 0603_1608]
SW3  FSM4JSMATR  [TECO-FSM4JSMATR_V]
SW4  FSM4JSMATR  [TECO-FSM4JSMATR_V]
U3  S25FL128SAGMFI011  [SPSN-SOIC-16_L]  (parts A,B of 2)

### Ports
FLASH (bidir, harness FLASH), MCU_BUTTONS (bidir, harness MCU_BUTTONS), MCU_LEDS (harness MCU_LEDS)

### Harnesses
MCU_LEDS: LED_01, LED_02, LED_03
FLASH: FLASH_IO3, FLASH_IO2, FLASH_CS, FLASH_IO1, FLASH_IO0, FLASK_SCK
MCU_BUTTONS: BTN_1, BTN_2

### Nets
3V3_MCU: C25.2 R17.2 R18.2 R19.1 R20.1 R21.1 U3.2(VCC)
GND: C25.1 SW3.3 SW4.3 U3.10(VSS)
NetD5_1: D5.1 R19.2
NetD5_2: D5.2 ; port MCU_LEDS.LED_01
NetD6_1: D6.1 R20.2
NetD6_2: D6.2 ; port MCU_LEDS.LED_02
NetD7_1: D7.1 R21.2
NetD7_2: D7.2 ; port MCU_LEDS.LED_03
NetIC1_P79: R17.1 SW3.2 ; port MCU_BUTTONS.BTN_1
NetIC1_P83: R18.1 SW4.2 ; port MCU_BUTTONS.BTN_2
NetIC1_P118: U3.16(SCK) ; port FLASH.FLASK_SCK
NetIC1_P119: U3.1(HOLD#/IO3) ; port FLASH.FLASH_IO3
NetIC1_P121: U3.9(WP#/IO2) ; port FLASH.FLASH_IO2
NetIC1_P122: U3.8(SO/IO1) ; port FLASH.FLASH_IO1
NetIC1_P123: U3.15(SI/IO0) ; port FLASH.FLASH_IO0
NetIC1_P124: U3.7(CS#) ; port FLASH.FLASH_CS

Not connected (* = marked no-connect by the designer): SW3 1* 4*; SW4 1* 4*; U3 3(RFU) 4(DNU)* 5(DNU)* 6(RFU) 11(DNU)* 12(DNU)* 13(NC)* 14(RFU)

### Library data of the parts
C25 = C0603C104K5RAC7411: as C5 on sheet mcu_core; Part Number: C0603C104K5RAC7411; Value: 0.1µF; Applications: Bypass, Decoupling; Capacitance: 0.1µF; ComponentLink1Description: Datasheet; ComponentLink1URL: https://api.kemet.com/component-edge/download/datasheet/C0603C104K5RAC7411.pdf; ComponentLink2Description: DigiKey Link; ComponentLink2URL: http://digikey.com/product-detail/en/kemet/C0603C104K5RAC7411/399-7374-2-ND/3317013; Device Package: 0603 (1608 Metric); LastUpdated: 02.09.2020 1:03:36; Lifecycle Status: Active; Minimum Order: 15000; Mounting Type: Surface Mount, MLCC; Operating Temperature: -55°C ~ 125°C; Package / Case: 0603 (1608 Metric); Packaging: TapeAndReel; PartId: 2233; Part Status: Active; Price: 0.02; Series: SMD Comm X7R; Size / Dimension: 0.063" L x 0.031" W (1.60mm x 0.80mm); Supplier 1: DigiKey; Supplier Part Number 1: 399-7374-2-ND; Temperature Coefficient: X7R; Thickness (Max): 0.035" (0.90mm); Voltage - Rated: 50V
D5-D7 = VLMB1300-GS08: as D1 on sheet mcu_core; Part Number: VLMB1300-GS08; Color: Blue; ComponentLink1Description: Datasheet; ComponentLink1URL: http://www.vishay.com/docs/82437/vlmo1300.pdf; ComponentLink2Description: DigiKey Link; ComponentLink2URL: http://digikey.com/product-detail/en/vishay-semiconductor-opto-division/VLMB1300-GS08/VLMB1300-GS08CT-ND/3025485; Device Package: 0603 (1608 Metric); Height (Max): 1.00mm; LastUpdated: 02.09.2020 1:20:26; Lifecycle Status: Active; Minimum Order: 1; Mounting Type: Surface Mount; Package / Case: 0603 (1608 Metric); Packaging: TapeAndReel; PartId: 785; Part Status: Active; Price: 0.08; Series: CHIPLED; Size / Dimension: 1.60mm L x 0.80mm W; Supplier 1: DigiKey; Supplier Part Number 1: VLMB1300-GS08CT-ND; Supplier Device Package: 0603; Value: Blue
R17 R18 = CRCW0603470RJNEAHP: RES SMD 470 OHM 5% 1/4W 0603; Manufacturer: Vishay Dale; Power (Watts): 0.25W, 1/4W; Resistance: 470 Ohms; Temperature Coefficient: ±200ppm/°C; Part Number: CRCW0603470RJNEAHP; Value: 10K Ohms; ComponentLink1Description: Datasheet; ComponentLink1URL: http://www.vishay.com/docs/20043/crcwhpe3.pdf; ComponentLink2Description: DigiKey Link; ComponentLink2URL: http://digikey.com/product-detail/en/vishay-dale/CRCW0603470RJNEAHP/541-470SACT-ND/2222809; Composition: Thick Film; Device Package: 0603 (1608 Metric); Features: Automotive AEC-Q200, Pulse Withstanding; Height - Seated (Max): 0.022" (0.55mm); LastUpdated: 02.09.2020 1:09:49; Lifecycle Status: Active; Minimum Order: 1; Number of Terminations: 2; Operating Temperature: -55°C ~ 155°C; Package / Case: 0603 (1608 Metric); Packaging: TapeAndReel; PartId: 21320; Part Status: Active; Price: 0.02; Ratings: AEC-Q200; Series: CRCW-HP; Size / Dimension: 0.063" L x 0.033" W (1.60mm x 0.85mm); Supplier Device Package: 0603; Tolerance: ±5%; Supplier 1: Farnell; Supplier Part Number 1: 3495224
R19-R21 = CRCW0603470RJNEAHP: as R10 on sheet mcu_debug; Part Number: CRCW0603470RJNEAHP; Value: 470 Ohms; ComponentLink1Description: Datasheet; ComponentLink1URL: http://www.vishay.com/docs/20043/crcwhpe3.pdf; ComponentLink2Description: DigiKey Link; ComponentLink2URL: http://digikey.com/product-detail/en/vishay-dale/CRCW0603470RJNEAHP/541-470SACT-ND/2222809; Composition: Thick Film; Device Package: 0603 (1608 Metric); Features: Automotive AEC-Q200, Pulse Withstanding; Height - Seated (Max): 0.022" (0.55mm); LastUpdated: 02.09.2020 1:09:49; Lifecycle Status: Active; Minimum Order: 1; Number of Terminations: 2; Operating Temperature: -55°C ~ 155°C; Package / Case: 0603 (1608 Metric); Packaging: TapeAndReel; PartId: 21320; Part Status: Active; Price: 0.02; Ratings: AEC-Q200; Resistance: 470 Ohms; Series: CRCW-HP; Size / Dimension: 0.063" L x 0.033" W (1.60mm x 0.85mm); Supplier 1: DigiKey; Supplier Part Number 1: 541-470SACT-ND; Supplier Device Package: 0603; Tolerance: ±5%
SW3 SW4 = CMP-2000-07486-1: as SW1 on sheet mcu_core; Termination: GullWing; Contact Plating: Silver; Orientation: Straight; Mounting Technology: SurfaceMount; REACH SVHC: Unknown; Electrical Life: 100000Cycles; Package Reference: FSM4JSMATR; Max Operating Temperature: 85degC; Manufacturer URL: http://www.te.com/; Package Description: 4-Pin Surface Mount Device, Body 6 x 6 mm, Pitch 4.5 mm; Datasheet Version: Rev. V, 02/2015; Packaging: TapeandReel; Min Operating Temperature: -35degC; Mount: SurfaceMount; Contact Current Rating: 50mA; Contact Material: CopperAlloy; Package Quantity: 1200; Datasheet URL: http://www.te.com/commerce/DocumentDelivery/DDEController?Action=showdoc&DocId=Customer+Drawing%7F2-1437565-7%7FV%7Fpdf%7FEnglish%7FENG_CD_2-1437565-7_V.pdf%7F4-1437565-2; RoHSCompliant: true
U3 = CMP-1329-00018-1: MirrorBit Flash Non-Volatile Memory CMOS 3.0 Volt Core with Versatile I/O, Serial Peripheral Interface with Multi-I/O, 128 Mbit, 133 MHz, -40 to 85 degC, 16-Pin SO (SO3016), RoHS, Tube; Manufacturer: Spansion; OTP: 1024 B; VCC: 2.7 to 3.6 V; Speed: 133 MHz; PackageDescription: 16-Pin Wide Plastic Small Outline Package, Body 10.3 x 7.5 mm, Pitch 1.27 mm; Density: 128 Mbit; ComponentLink3URL: http://www.spansion.com/Support/Datasheets/S25FL128S_256S_00.pdf; DatasheetVersion: Rev. 08; ComponentLink2Description: Datasheet; ComponentLink3Description: Package Specification; PartNumber: S25FL128SAGMFI011; ComponentLink1Description: Manufacturer URL; ComponentLink1URL: http://www.spansion.com/Pages/Default.aspx; Mounting Technology: Surface Mount; Temperature Range: -40 to 85 degC; ComponentLink2URL: http://www.spansion.com/Support/Datasheets/S25FL128S_256S_00.pdf; RoHS: TRUE; Packing: Tube

## Sheet mcu_power.SchDoc
size A4
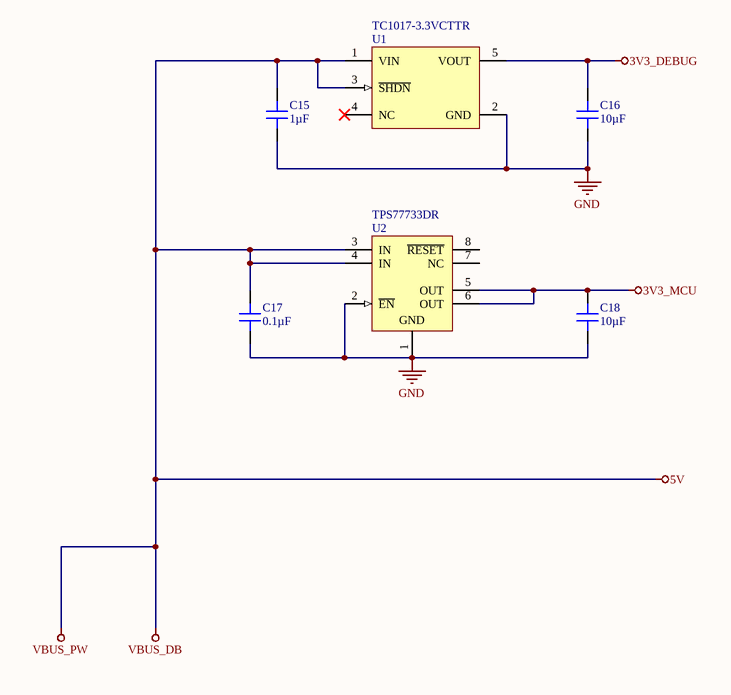
[diagram p4: mcu_power.SchDoc]

### Parts
C15  1µF  [CAP 0603_1608]
C16  10µF  [CAP 0603_1608]
C17  0.1µF  [CAP 0603_1608]
C18  10µF  [CAP 0603_1608]
U1  TC1017-3.3VCTTR  [SOT-23-CT5_L]
U2  TPS77733DR  [D0008A_N]

### Nets
3V3_DEBUG: C16.2 U1.5(VOUT)
3V3_MCU: C18.2 U2.5(OUT) U2.6(OUT)
5V: C15.2 C17.2 U1.1(VIN) U1.3(~{SHDN}) U2.3(IN) U2.4(IN)  [also labelled VBUS_DB, VBUS_PW]
GND: C15.1 C16.1 C17.1 C18.1 U1.2(GND) U2.1(GND) U2.2(~{EN})

Not connected (* = marked no-connect by the designer): U1 4(NC)*; U2 7(NC) 8(~{RESET})

### Library data of the parts
C15 = C0603X105M4RACAUTO: CAP CER 0603 1UF 16V X7R 20%; Manufacturer: KEMET; Part Number: C0603X105M4RACAUTO; Value: 1µF; Applications: Automotive, Boardflex Sensitive; Capacitance: 1µF; ComponentLink1Description: Datasheet; ComponentLink1URL: https://api.kemet.com/component-edge/download/datasheet/C0603X105M4RACAUTO.pdf; ComponentLink2Description: DigiKey Link; ComponentLink2URL: http://digikey.com/product-detail/en/kemet/C0603X105M4RACAUTO/399-17719-1-ND/8635870; Device Package: 0603 (1608 Metric); Features: Soft Termination; LastUpdated: 02.09.2020 1:03:33; Lifecycle Status: Active; Minimum Order: 1; Mounting Type: Surface Mount, MLCC; Operating Temperature: -55°C ~ 125°C; Package / Case: 0603 (1608 Metric); Packaging: TapeAndReel; PartId: 3927; Part Status: Active; Price: 0.07; Ratings: AEC-Q200; Series: SMD Auto X7R Flex; Size / Dimension: 0.063" L x 0.031" W (1.60mm x 0.80mm); Supplier 1: DigiKey; Supplier Part Number 1: 399-17719-1-ND; Temperature Coefficient: X7R; Thickness (Max): 0.037" (0.95mm); Tolerance: ±20%; Voltage - Rated: 16V
C16 C18 = GRT188R61C106KE13D: CAP CER 10UF 16V X5R 0603; Manufacturer: Murata Electronics; Tolerance: ±10%; Part Number: GRT188R61C106KE13D; Value: 10µF; Applications: Automotive; Capacitance: 10µF; ComponentLink1Description: Datasheet; ComponentLink1URL: https://search.murata.co.jp/Ceramy/image/img/A01X/G101/ENG/GRT188R61C106KE13-01.pdf; ComponentLink2Description: DigiKey Link; ComponentLink2URL: http://digikey.com/product-detail/en/murata-electronics/GRT188R61C106KE13D/490-12317-1-ND/5417018; Device Package: 0603 (1608 Metric); LastUpdated: 02.09.2020 1:03:11; Lifecycle Status: Active; Minimum Order: 1; Mounting Type: Surface Mount, MLCC; Operating Temperature: -55°C ~ 85°C; Package / Case: 0603 (1608 Metric); Packaging: TapeAndReel; PartId: 14922; Part Status: Active; Price: 0.10; Ratings: AEC-Q200; Series: GRT; Size / Dimension: 0.063" L x 0.031" W (1.60mm x 0.80mm); Supplier 1: DigiKey; Supplier Part Number 1: 490-12317-1-ND; Temperature Coefficient: X5R; Thickness (Max): 0.035" (0.90mm); Voltage - Rated: 16V
C17 = CS0603KRX7R7BB104: CAP CER 0.1UF 16V X7R 0603; Manufacturer: Yageo; Tolerance: ±10%; Part Number: CS0603KRX7R7BB104; Value: 0.1µF; Applications: Boardflex Sensitive; Capacitance: 0.1µF; ComponentLink1Description: Datasheet; ComponentLink1URL: http://www.yageo.com/NewPortal/yageodocoutput?fileName=/pdf/MLCC/UPY-ST_NPOX7R_16V-to-3KV_5.pdf; ComponentLink2Description: DigiKey Link; ComponentLink2URL: http://digikey.com/product-detail/en/yageo/CS0603KRX7R7BB104/311-3560-1-ND/7648487; Device Package: 0603 (1608 Metric); Features: Soft Termination; LastUpdated: 02.09.2020 1:03:36; Lifecycle Status: Active; Minimum Order: 1; Mounting Type: Surface Mount, MLCC; Operating Temperature: -55°C ~ 125°C; Package / Case: 0603 (1608 Metric); Packaging: TapeAndReel; PartId: 2286; Part Status: Active; Price: 0.02; Series: CS; Size / Dimension: 0.063" L x 0.031" W (1.60mm x 0.80mm); Supplier 1: DigiKey; Supplier Part Number 1: 311-3560-1-ND; Temperature Coefficient: X7R; Thickness (Max): 0.037" (0.95mm); Voltage - Rated: 16V
U1 = CMP-0136-00743-1: 150 mA, Tiny CMOS LDO with Shutdown, 5-Pin SOT-23, Extended Temperature, Tape and Reel; Code_IPC: SOT23-5; PackageVersion: revBB, Aug-2009; PackageDescription: 5-Lead Plastic Small Outline Transistor (CT) [SOT-23]; DatasheetVersion: revD, 2005; PackageReference: SOT-23-CT5
U2 = CMP-0395-00062-2: Single Output Fast Transient Response LDO, 750 mA, Fixed 3.3 V Output, 2.7 to 10 V Input, 8-pin SOIC (D), -40 to 125 degC, Green (RoHS & no Sb/Br); Manufacturer: Texas Instruments; Fixed Output Options(V): 3.3; Vin(Max)(V): 10; Vin(Min)(V): 2.7; Iout(Max)(A): 0.75; Iq(Typ)(mA): 0.08; Vdo(Typ)(mV): 260; SubFamily: Single Channel LDO; Accuracy(%): 2; Eco-Plan: Green (RoHS & no Sb/Br); ComponentLink1Description: Manufacturer URL; DatasheetVersion: SLVS230G; PackageVersion: 4040047-3/M; PackageReference: D0008A; ComponentLink2URL: http://www.ti.com/general/docs/lit/getliterature.tsp?genericPartNumber=TPS77733&fileType=pdf; PartNumber: TPS77733DR; ComponentLink3Description: Package Specification; Mounting Technology: Surface Mount; ComponentLink2Description: Datasheet; ComponentLink3URL: http://www.ti.com/litv/pdf/msoi002j; Vout Adj(Max)(V): 3.3; Code_JEDEC: MS-012; Vout Adj(Min)(V): 3.3; PackageDescription: 8-Pin Plastic Small Outline, Body 4.9 x 3.9 mm, Pitch 1.27 mm; ComponentLink1URL: http://www.ti.com/